# Altium schematic sheet PSRAM.SchDoc: param:Title
size A4; Author: param.Autor; Version: param:Version
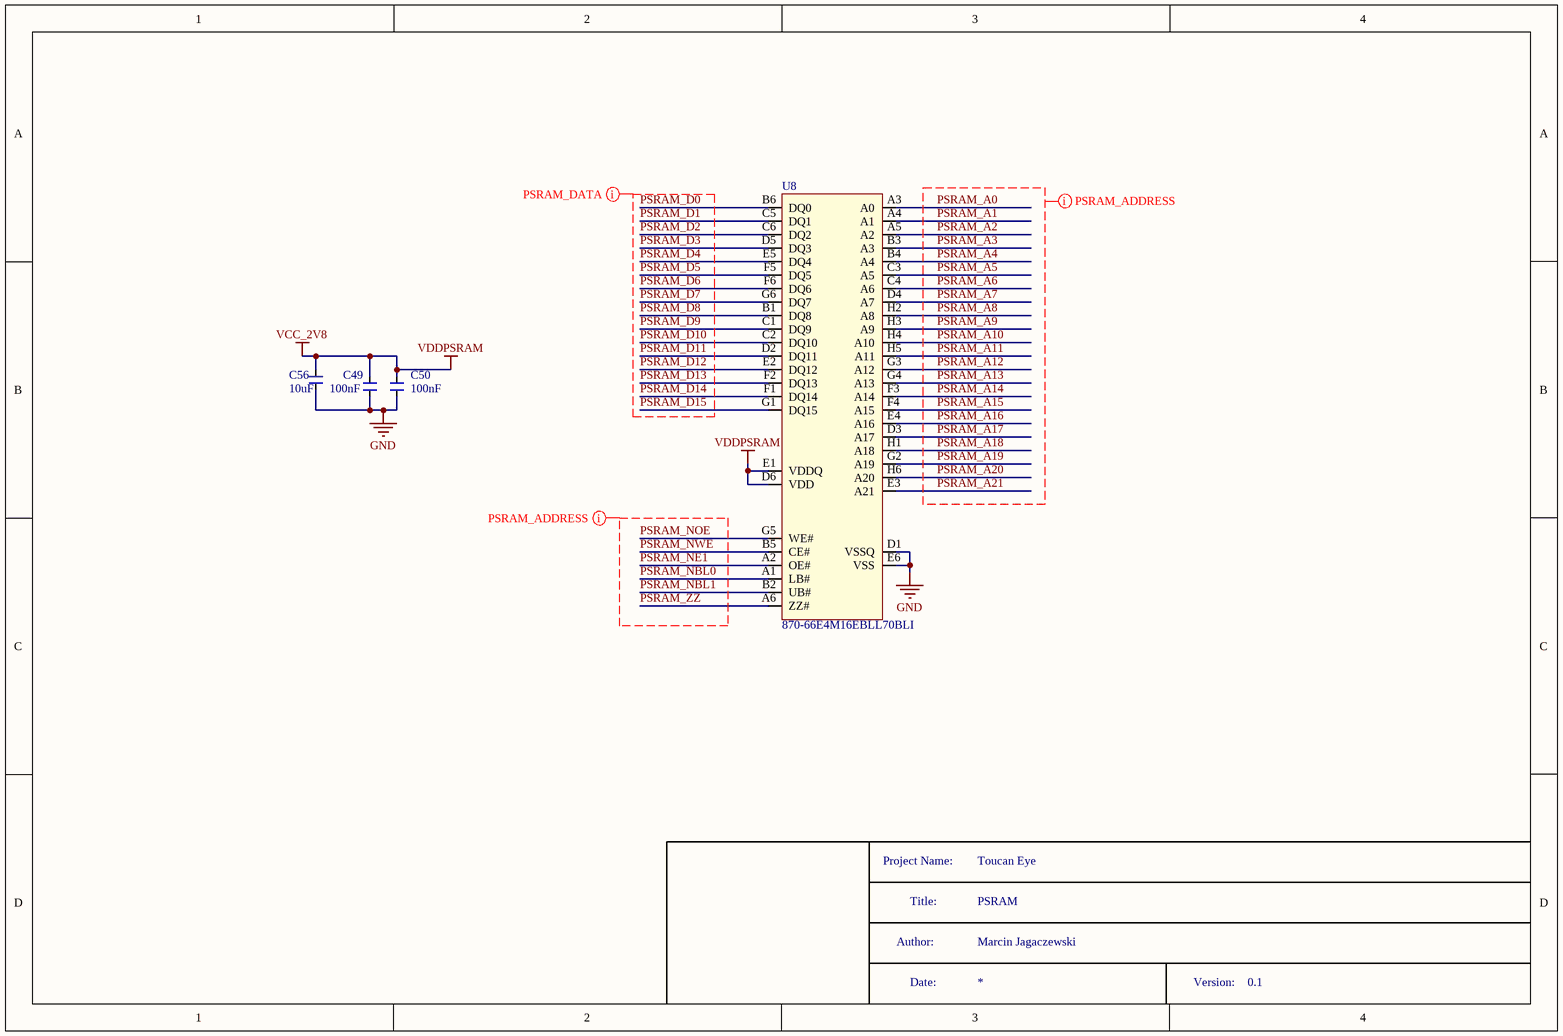
[diagram p0: PSRAM.SchDoc]

## Parts
C49  Capacitance: 100nF  [C_0201]  (hidden comment: C0201_100n_GRM033R6YA104KE14D)
C50  Capacitance: 100nF  [C_0201]  (hidden comment: C0201_100n_GRM033R6YA104KE14D)
C56  Capacitance: 10uF  [C_0402]  (hidden comment: C0402_10u_GRM155C80J106ME11D)
U8  Supplier Part Number 1: 870-66E4M16EBLL70BLI  [BGA48C75P6X8_600X800X120]  (hidden comment: IS66WVE4M16EBLL-70BLI)

## Nets
GND: C49.1 C50.1 C56.1 U8.D1(VSSQ) U8.E6(VSS)
VCC_2V8: C49.2 C50.2 C56.2 U8.D6(VDD) U8.E1(VDDQ)  [also labelled VDDPSRAM]
PSRAM_A0: U8.A3(A0)
PSRAM_A1: U8.A4(A1)
PSRAM_A2: U8.A5(A2)
PSRAM_A3: U8.B3(A3)
PSRAM_A4: U8.B4(A4)
PSRAM_A5: U8.C3(A5)
PSRAM_A6: U8.C4(A6)
PSRAM_A7: U8.D4(A7)
PSRAM_A8: U8.H2(A8)
PSRAM_A9: U8.H3(A9)
PSRAM_A10: U8.H4(A10)
PSRAM_A11: U8.H5(A11)
PSRAM_A12: U8.G3(A12)
PSRAM_A13: U8.G4(A13)
PSRAM_A14: U8.F3(A14)
PSRAM_A15: U8.F4(A15)
PSRAM_A16: U8.E4(A16)
PSRAM_A17: U8.D3(A17)
PSRAM_A18: U8.H1(A18)
PSRAM_A19: U8.G2(A19)
PSRAM_A20: U8.H6(A20)
PSRAM_A21: U8.E3(A21)
PSRAM_D0: U8.B6(DQ0)
PSRAM_D1: U8.C5(DQ1)
PSRAM_D2: U8.C6(DQ2)
PSRAM_D3: U8.D5(DQ3)
PSRAM_D4: U8.E5(DQ4)
PSRAM_D5: U8.F5(DQ5)
PSRAM_D6: U8.F6(DQ6)
PSRAM_D7: U8.G6(DQ7)
PSRAM_D8: U8.B1(DQ8)
PSRAM_D9: U8.C1(DQ9)
PSRAM_D10: U8.C2(DQ10)
PSRAM_D11: U8.D2(DQ11)
PSRAM_D12: U8.E2(DQ12)
PSRAM_D13: U8.F2(DQ13)
PSRAM_D14: U8.F1(DQ14)
PSRAM_D15: U8.G1(DQ15)
PSRAM_NBL0: U8.A1(LB#)
PSRAM_NBL1: U8.B2(UB#)
PSRAM_NE1: U8.A2(OE#)
PSRAM_NOE: U8.G5(WE#)
PSRAM_NWE: U8.B5(CE#)
PSRAM_ZZ: U8.A6(ZZ#)

## Layout directives
net class PSRAM_DATA: PSRAM_D0, PSRAM_D1, PSRAM_D2, PSRAM_D3, PSRAM_D4, PSRAM_D5, PSRAM_D6, PSRAM_D7, PSRAM_D8, PSRAM_D9, PSRAM_D10, PSRAM_D11, PSRAM_D12, PSRAM_D13, PSRAM_D14, PSRAM_D15
net class PSRAM_ADDRESS: PSRAM_A0, PSRAM_A1, PSRAM_A2, PSRAM_A3, PSRAM_A4, PSRAM_A5, PSRAM_A6, PSRAM_A7, PSRAM_A8, PSRAM_A9, PSRAM_A10, PSRAM_A11, PSRAM_A12, PSRAM_A13, PSRAM_A14, PSRAM_A15, PSRAM_A16, PSRAM_A17, PSRAM_A18, PSRAM_A19, PSRAM_A20, PSRAM_A21, PSRAM_NBL0, PSRAM_NBL1, PSRAM_NE1, PSRAM_NOE, PSRAM_NWE, PSRAM_ZZ

## Notes on the sheet
- Project Name:
- Title:
- PSRAM
- Toucan Eye
- Author:
- Date:
- Marcin Jagaczewski
- Version:
- 0.1

## Library data of the parts
C49 C50 = C0201_100n_GRM033R6YA104KE14D: Multilayer Ceramic Capacitors MLCC - SMD/SMT 0201 0.10uF 35volts *Derate Voltage/Temp; Manufacturer: Murata; Tolerance: 10%; Dielectric: X5R; Voltage Rating (DC): 35V; Supplier 1: Mouser; Manufacturer Part Number: GRM033R6YA104KE14D; Stock 1: 295799; Pricing 1: 1=0.1, 10=0.061, 50=0.061, 100=0.027, 1000=0.015, 10000=0.01 (USD); Mount: Surface Mount; Case/Package: 0201; Weight: 1.2E-05oz; Case Code (Metric): 0603; Case Code (Imperial): 0201; Min Operating Temperature: -55°C; Max Operating Temperature: 85°C; Packaging: Tape and Reel; Voltage Rating: 35V; Termination: SMD/SMT; Package Quantity: 15000; Length: 0.024inch; Height: 0.3mm; Width: 0.3mm; Thickness: 0.013inch; ComponentLink1URL: http://www.mouser.com/ds/2/281/c02e-2905.pdf; ComponentLink1Description: http://www.mouser.com/ds/2/281/c02e-2905.pdf; ComponentLink2URL: http://search.murata.co.jp/Ceramy/image/img/A01X/partnumbering_e_01.pdf; ComponentLink2Description: http://search.murata.co.jp/Ceramy/image/img/A01X/partnumbering_e_01.pdf; *SCHChecked: *; *PCBChecked: *; Supplier Part Number 1: 81-GRM33R6YA104KE14D
C56 = C0402_10u_GRM155C80J106ME11D: 10µF 6.3V Ceramic Capacitor X6S 0402 (1005 Metric) 0.039" L x 0.020" W (1.00mm x 0.50mm); Manufacturer: Murata; Tolerance: 20%; *SCHChecked: 1; Supplier 1: Mouser; Manufacturer Part Number: GRM155C80J106ME11D; Stock 1: 134415; Pricing 1: 1=0.17, 10=0.125, 50=0.125, 100=0.059, 1000=0.034, 10000=0.024 (USD); Mount: Surface Mount; Case/Package: 0402; Case Code (Metric): 1005; Case Code (Imperial): 0402; Min Operating Temperature: -55°C; Max Operating Temperature: 105°C; Packaging: Tape and Reel; Voltage Rating: 6.3V; Voltage Rating (DC): 6.3V; Dielectric: X6S; Length: 0.039inch; Width: 0.02inch; Thickness: 0.028inch; ComponentLink1URL: http://search.murata.co.jp/Ceramy/image/img/A01X/partnumbering_e_01.pdf; ComponentLink1Description: http://search.murata.co.jp/Ceramy/image/img/A01X/partnumbering_e_01.pdf; Supplier Part Number 1: 81-GRM155C80J106ME1D; *PCBChecked: 1
U8 = IS66WVE4M16EBLL-70BLI: PSRAM Async 64M-Bit 4M x 16 70ns 48-Pin TFBGA; Manufacturer: ISSI; Density: 64Mb; Address Bus Width: 22b; Number of Ports: 1; Supplier 1: Mouser; Manufacturer Part Number: IS66WVE4M16EBLL-70BLI; Stock 1: 3544; Pricing 1: 1=4.47, 10=3.94, 50=3.94, 100=3.53, 1000=3.01, 10000=2.85 (USD); Case/Package: TFBGA; Min Operating Temperature: -40°C; Max Operating Temperature: 85°C; ComponentLink1URL: http://www.mouser.com/ds/2/198/66-67WVE4M16EALL-BLL-CLL-462616.pdf; ComponentLink1Description: http://www.mouser.com/ds/2/198/66-67WVE4M16EALL-BLL-CLL-462616.pdf; ComponentLink2URL: http://www.issi.com/WW/pdf/66-67WVE4M16EALL-BLL-CLL.pdf; ComponentLink2Description: http://www.issi.com/WW/pdf/66-67WVE4M16EALL-BLL-CLL.pdf; *SCHChecked: 1; *PCBChecked: 1